# Altium schematic sheet sim_ckt.SchDoc
size 431 x 279 mm; SheetNumber: 1; SheetTotal: 2; SPICEModelCacheAEYVMEZK: <root> / <DocumentId>AEYVMEZK</DocumentId> / <CacheFrame Number="0"> / <Model Name="ad630" Kind="CKT"> / <Text>* AD630 SPICE Macro-model / * Description: Amplifier / * Generic Desc: Bipolar,  Balanced Modulator/Demod / * Developed by: ARG / PMI / * Revision History: 08/10/2012 - Updated to new header style / * 2.0 / *    Changed R1 and R2 to 20k ohms to meet comparator input voltage spec. / *    Changed E1 gain to 100k to better meet minimum comparator diff. input / *    spec. / *    Changed DZ breakdown from 30V to 50V. / *    Changed Ios1,Ios2 to 25E-9 and changed polarity. / * Copyright 1993, 2012 by Analog Devices. / * / * Refer to http://www.analog.com/Analog_Root/static/techSupport/designTools/spiceModels/license/spice_general.html for License Statement. Use of this model / * indicates your acceptance with the terms and provisions in the License Statement. / * / * BEGIN Notes: / * / * Not Modeled: / * / * Parameters modeled include: / * / * END Notes / * / * Node assignments / *             chan A non-inverting input / *             |  chan A inverting input / *             |  |  RIN A / *             |  |  |  chan B non-inverting input / *             |  |  |  |  chan B inverting input / *             |  |  |  |  |  RIN B / *             |  |  |  |  |  |  sel A / *             |  |  |  |  |  |  |  sel B / *             |  |  |  |  |  |  |  |  RB / *             |  |  |  |  |  |  |  |  |  RF / *             |  |  |  |  |  |  |  |  |  |  RA / *             |  |  |  |  |  |  |  |  |  |  |  comp / *             |  |  |  |  |  |  |  |  |  |  |  |  status / *             |  |  |  |  |  |  |  |  |  |  |  |  |  pos supply / *             |  |  |  |  |  |  |  |  |  |  |  |  |  |  neg supply / *             |  |  |  |  |  |  |  |  |  |  |  |  |  |  |  output / *             |  |  |  |  |  |  |  |  |  |  |  |  |  |  |  | / .SUBCKT AD630 11 10 19 21 20 24 25 29 47 49 48 52 51 99 50 46 / * / * COMPARATOR / * / V1   99   97   1 / I1   97   1    100.2E-6 / D1   1    97   DX / Q1   3    2    1    QP / Q2   5    4    1    QP / R1   3    50   20E3 / R2   5    50   20E3 / R4   25   2    1E3 / R5   29   4    1E3 / * / * COMPARATOR GAIN AND CLAMP / * / EREF 98   0    100 0 1 / E1   6    98   5 3 100E3 / R3   6    7    1E6 / D2   7    8    DX / D3   9    7    DX / V6   8    98   .2429 / V7   98   9    .2429 / Q7   51   53   50   QN / G11  99   53   7 100 100E-6 / D14  53   99   DY / * / * CHANNEL A AMPLIFIER AND POLE AT 1.7MHZ / * / R6   10   13   5E11 / R7   11   13   5E11 / IOS1 11   10   -5E-9 / CIN1 10   11   1E-12 / Q3   14   10   16   QN / Q4   15   12   17   QN / R8   99   14   12.736E3 / R9   99   15   12.736E3 / C1   14   15   3.675E-12 / R10  16   18   12.220E3 / R11  17   18   12.220E3 / G2   18   50   7 100 100.2E-6 / D4   50   18   DZ / R17  19   11   2.5E3 / EOS1 12   11   POLY(1) 35 100 50E-6 1 / * / * CHANNEL B AMPLIFIER / * / R12  20   23   5E11 / R13  23   21   5E11 / IOS2 21   20   -5E-9 / CIN2 20   21   1E-12 / Q5   14   20   26   QN / Q6   15   22   27   QN / R14  26   28   12.220E3 / R15  27   28   12.220E3 / G3   28   50   100 7 100.2E-6 / D5   50   28   DZ / R18  24   21   2.5E3 / EOS2 22   21   POLY(1) 37 100 50E-6 1 / * / * GAIN STAGE, SLEW RATE, AND DOMINANT POLE AT 5.623HZ / * / G1   98   30   15 14 78.518E-6 / RPI  30   98   12.736E3 / C2   30   33   2.222E-12 / GM1  33   98   30 0 1 / RL   33   98   1E6 / CC   30   52   2.75E-12 / D6   33   31   DX / D7   32   33   DX / V2   99   31   1.42 / V3   32   50   1.53 / * / * AMP A COMMON MODE STAGE AND ZERO AT 100HZ / * / R20  34   35   1E6 / R21  35   98   1 / C3   34   35   1.592E-9 / ECMA 34   98   13 100 3.162 / * / * AMP B COMMON MODE STAGE AND ZERO AT 100HZ / * / R22  36   37   1E6 / R23  37   98   1 / C4   36   37   1.592E-9 / ECMB 36   98   23 100 3.162 / * / * POLE AT 20MHZ / * / G5   98   39   33 100 1E-6 / R25  39   98   1E6 / C6   39   98   7.958E-15 / * / * POLE AT 20MHZ / * / G6   98   40   39 100 1E-6 / R26  40   98   1E6 / C7   40   98   7.958E-15 / * / * OUTPUT STAGE / * / ISY  99   50   3.6E-3 / R27  99   100  32.86E3 / R28  100  50   32.86E3 / R29  99   45   200 / R30  45   50   200 / L1   45   46   1E-10 / G9   45   99   99 40 5E-3 / G10  50   45   40 50 5E-3 / G7   43   50   40 45 5E-3 / G8   44   50   45 40 5E-3 / V4   41   45   1.9 / V5   45   42   1.9 / D8   40   41   DX / D9   42   40   DX / D10  99   43   DX / D11  99   44   DX / D12  50   43   DY / D13  50   44   DY / R31  46   49   10E3 / R32  49   47   10E3 / R33  49   48   5E3 / .MODEL QP PNP(BF=500) / .MODEL QN NPN(BF=500) / .MODEL DX D / .MODEL DY D(BV=50) / .MODEL DZ D(BV=50) / .ENDS AD630</Text> / </Model> / <Model Name="ada4610" Kind="CKT"> / <Text>*ADA4610 Macro-model / *Function:Amplifier / * / *Revision History: / *Rev.2.1 Feb 2016-ZZ / *Copyright 2016 by Analog Devices / * / *Refer to http://www.analog.com/Analog_Root/static/techSupport/designTools/spicemodels/license / *for License Statement. Use of this model indicates your acceptance / *of the terms and provisions in the License Staement. / * / *Tested on MultSIm, SiMetrix(NGSpice), PSpice / * / *Not modeled: Distortion, PSRR, Overload Recovery, / *             Shutdown Turn On/Turn Off time / * / *Parameters modeled include: / *   Vos, Ibias, Input CM limits and Typ output voltge swing over full supply range, / *   Open Loop Gain &amp; Phase, Slew Rate, Output current limits, Voltage &amp; Current Noise over temp, / *   Capacitive load drive, Quiescent and dynamic supply currents, / *   Shut Down pin functionality where applicable, / *   Single supply &amp; offset supply functionality. / * / *Node Assignments / *                Non-Inverting Input / *                |   Inverting Input / *                |   |   Positive supply / *                |   |   |   Negative supply / *                |   |   |   |   Output / *                |   |   |   |   | / .Subckt ADA4610 100 101 102 103 104 / *#ASSOC Category="Op-Amps" symbol=opamp / ***Power Supplies*** / Rz1    102    1020    Rideal    1e-6 / Rz2    103    1030    Rideal    1e-6 / Ibias    1020    1030    dc    0.33e-3 / DzPS    98    1020    diode / Iquies    1020    98    dc    2.97e-3 / S1    98    1030    106    113    Switch / R1    1020    99    Rideal    1e7 / R2    99    1030    Rideal    1e7 / e1    111    110    1020    110    1 / e2    110    112    110    1030    1 / e3    110    0    99    0    1 / * / * / ***Inputs*** / S2    1    100    106    113    Switch / S3    9    101    106    113    Switch / VOS    1    2    dc    0.2e-6 / IbiasP    110    2    dc    5e-12 / IbiasN    110    9    dc    5e-12 / RinCMP    110    2    Rideal    20000000000000e6 / RinCMN    9    110    Rideal    20000000000000e6 / CinCMP    110    2    5.7e-12 / CinCMN    9    110    5.7e-12 / IOS    9    2    2e-12 / RinDiff    9    2    Rideal    20000000000000e3 / CinDiff    9    2    2.2e-12 / * / * / ***Non-Inverting Input with Clamp*** / g1    3    110    110    2    0.001 / RInP    3    110    Rideal    1e3 / RX1    40    3    Rideal    0.001 / DInP    40    41    diode / DInN    42    40    diode / VinP    111    41    dc    2.96 / VinN    42    112    dc    2.96 / * / * / ***Vnoise*** / hVn    6    5    Vmeas1    707.10678 / Vmeas1    20    110    DC    0 / Vvn    21    110    dc    0.65 / Dvn    21    20    DVnoisy / hVn1    6    7    Vmeas2    707.10678 / Vmeas2    22    110    dc    0 / Vvn1    23    110    dc    0.65 / Dvn1    23    22    DVnoisy / * / * / ***Inoise*** / FnIN    9    110    Vmeas3    0.7071068 / Vmeas3    51    110    dc    0 / VnIN    50    110    dc    0.65 / DnIN    50    51    DINnoisy / FnIN1    110    9    Vmeas4    0.7071068 / Vmeas4    53    110    dc    0 / VnIN1    52    110    dc    0.65 / DnIN1    52    53    DINnoisy / * / FnIP    2    110    Vmeas5    0.7071068 / Vmeas5    31    110    dc    0 / VnIP    30    110    dc    0.65 / DnIP    30    31    DIPnoisy / FnIP1    110    2    Vmeas6    0.7071068 / Vmeas6    33    110    dc    0 / VnIP1    32    110    dc    0.65 / DnIP1    32    33    DIPnoisy / * / * / ***CMRR*** / RcmrrP    3    10    Rideal    1e12 / RcmrrN    10    9    Rideal    1e12 / g10    11    110    10    110    -1e-10 / Lcmrr    11    12    1e-12 / Rcmrr    12    110    Rideal    1e3 / e4    5    3    11    110    1 / * / * / ***Power Down*** / VPD    111    80    dc    2 / VPD1    81    0    dc    1.5 / RPD    111    106    Rideal    0.286e6 / ePD    80    113    82    0    1 / RDP1    82    0    Rideal    1e3 / CPD    82    0    1e-10 / S5    81    82    83    113    Switch / CDP1    83    0    1e-12 / RPD2    106    83    1e6 / * / * / ***Feedback Pin*** / *RF    105    104    Rideal    0.001 / * / * / ***VFB Stage*** / g200    200    110    7    9    1 / R200    200    110    Rideal    250 / DzSlewP    201    200    DzSlewP / DzSlewN    201    110    DzSlewN / * / * / ***Dominant Pole at 350 Hz*** / g210    210    110    200    110    0.3502e-6 / R210    210    110    Rideal    454.73e6 / C210    210    110    1e-012 / * / * / ***Output Voltage Clamp-1*** / RX2    60    210    Rideal    0.001 / DzVoutP    61    60    DzVoutP / DzVoutN    60    62    DzVoutN / DVoutP    61    63    diode / DVoutN    64    62    diode / VoutP    65    63    dc    5.709 / VoutN    64    66    dc    5.428 / e60    65    110    111    110    1.34 / e61    66    110    112    110    1.34 / * / * / ***Pole-Zero at 84KHz, 180KHz*** / g220    220    110    210    110    0.001 / R220    220    110    Rideal    1000 / R221    220    221    Rideal    0.875e3 / C220    221    110    1010.5064e-12 / * / ***Pole at 110MHz*** / g230    230    110    220    110    0.001 / R230    230    110    Rideal    1000 / C230    230    110    1.4469e-12 / * / ***Buffer*** / g240    240    110    230    110    0.001 / R240    240    110    Rideal    1000 / * / ***Buffer*** / g245    245    110    240    110    0.001 / R245    245    110    Rideal    1000 / * / ***Buffer*** / g250    250    110    245    110    0.001 / R250    250    110    Rideal    1000 / * / ***Buffer*** / g255    255    110    250    110    0.001 / R255    255    110    Rideal    1000 / * / ***Buffer*** / g260    260    110    255    110    0.001 / R260    260    110    Rideal    1000 / * / ***Buffer*** / g265    265    110    260    110    0.001 / R265    265    110    Rideal    1000 / * / ***Buffer*** / g270    270    110    265    110    0.001 / R270    270    110    Rideal    1000 / * / ***Notch: f=2.2MHz, Zeta=1.2, Gain=0.8dB*** / e280    280    110    270    110    1 / R280    280    285    Rideal    10 / L280    285    281    3425.757e-9 / C280    281    282    1527.698e-12 / R281    282    110    Rideal    103.65 / * / ***Peak: f=0.5MHz, Zeta=3.1, Gain=5.1dB*** / e290    290    110    285    110    1 / R290    290    292    Rideal    10 / L290    290    291    513.402e-9 / C290    291    292    197351.907e-12 / R291    292    110    Rideal    12.518 / e295    295    110    292    110    1.7989 / * / * / ***Output Stage*** / g300    300    110    295    110    0.001 / R300    300    110    Rideal    1000 / e301    301    110    300    110    1 / Rout    302    303    Rideal     163 / Lout    303    310     80e-9 / Cout    310    110     6e-12 / * / * / ***Output Current Limit*** / H1    301    304    Vsense1    100 / Vsense1    301    302    dc    0 / VIoutP    305    304    dc    5.736 / VIoutN    304    306    dc    5.736 / DIoutP    307    305    diode / DIoutN    306    307    diode / Rx3    307    300    Rideal    0.001 / * / * / ***Output Clamp-2*** / VoutP1    111    73    dc    0.785 / VoutN1    74    112    dc    0.785 / DVoutP1    75    73    diode / DVoutN1    74    75    diode / RX4    75    310    Rideal    0.001 / * / * / ***Supply Currents*** / FIoVcc    314    110    Vmeas8    1 / Vmeas8    310    311    dc    0 / R314    110    314    Rideal    1e9 / DzOVcc    110    314    diode / DOVcc    102    314    diode / RX5    311    312    Rideal    0.001 / FIoVee    315    110    Vmeas9    1 / Vmeas9    312    313    dc    0 / R315    315    110    Rideal    1e9 / DzOVee    315    110    diode / DOVee    315    103    diode / * / * / ***Output Switch*** / S4    104    313    106    113    Switch / * / * / *** Common Models *** / .model    diode    d(bv=100) / .model    Switch    vswitch(Von=1.505,Voff=1.495,ron=0.001,roff=1e6) / .model    DzVoutP    D(BV=4.3) / .model    DzVoutN    D(BV=4.3) / .model    DzSlewP    D(BV=174.665) / .model    DzSlewN    D(BV=174.665) / .model    DVnoisy    D(IS=2.03e-15 KF=8.16e-18) / .model    DINnoisy    D(IS=1.45e-22 KF=8.13e-18) / .model    DIPnoisy    D(IS=1.45e-22 KF=8.13e-18) / .model    Rideal    res(T_ABS=-273) / * / .ends ADA4610</Text> / </Model> / </CacheFrame> / </root>
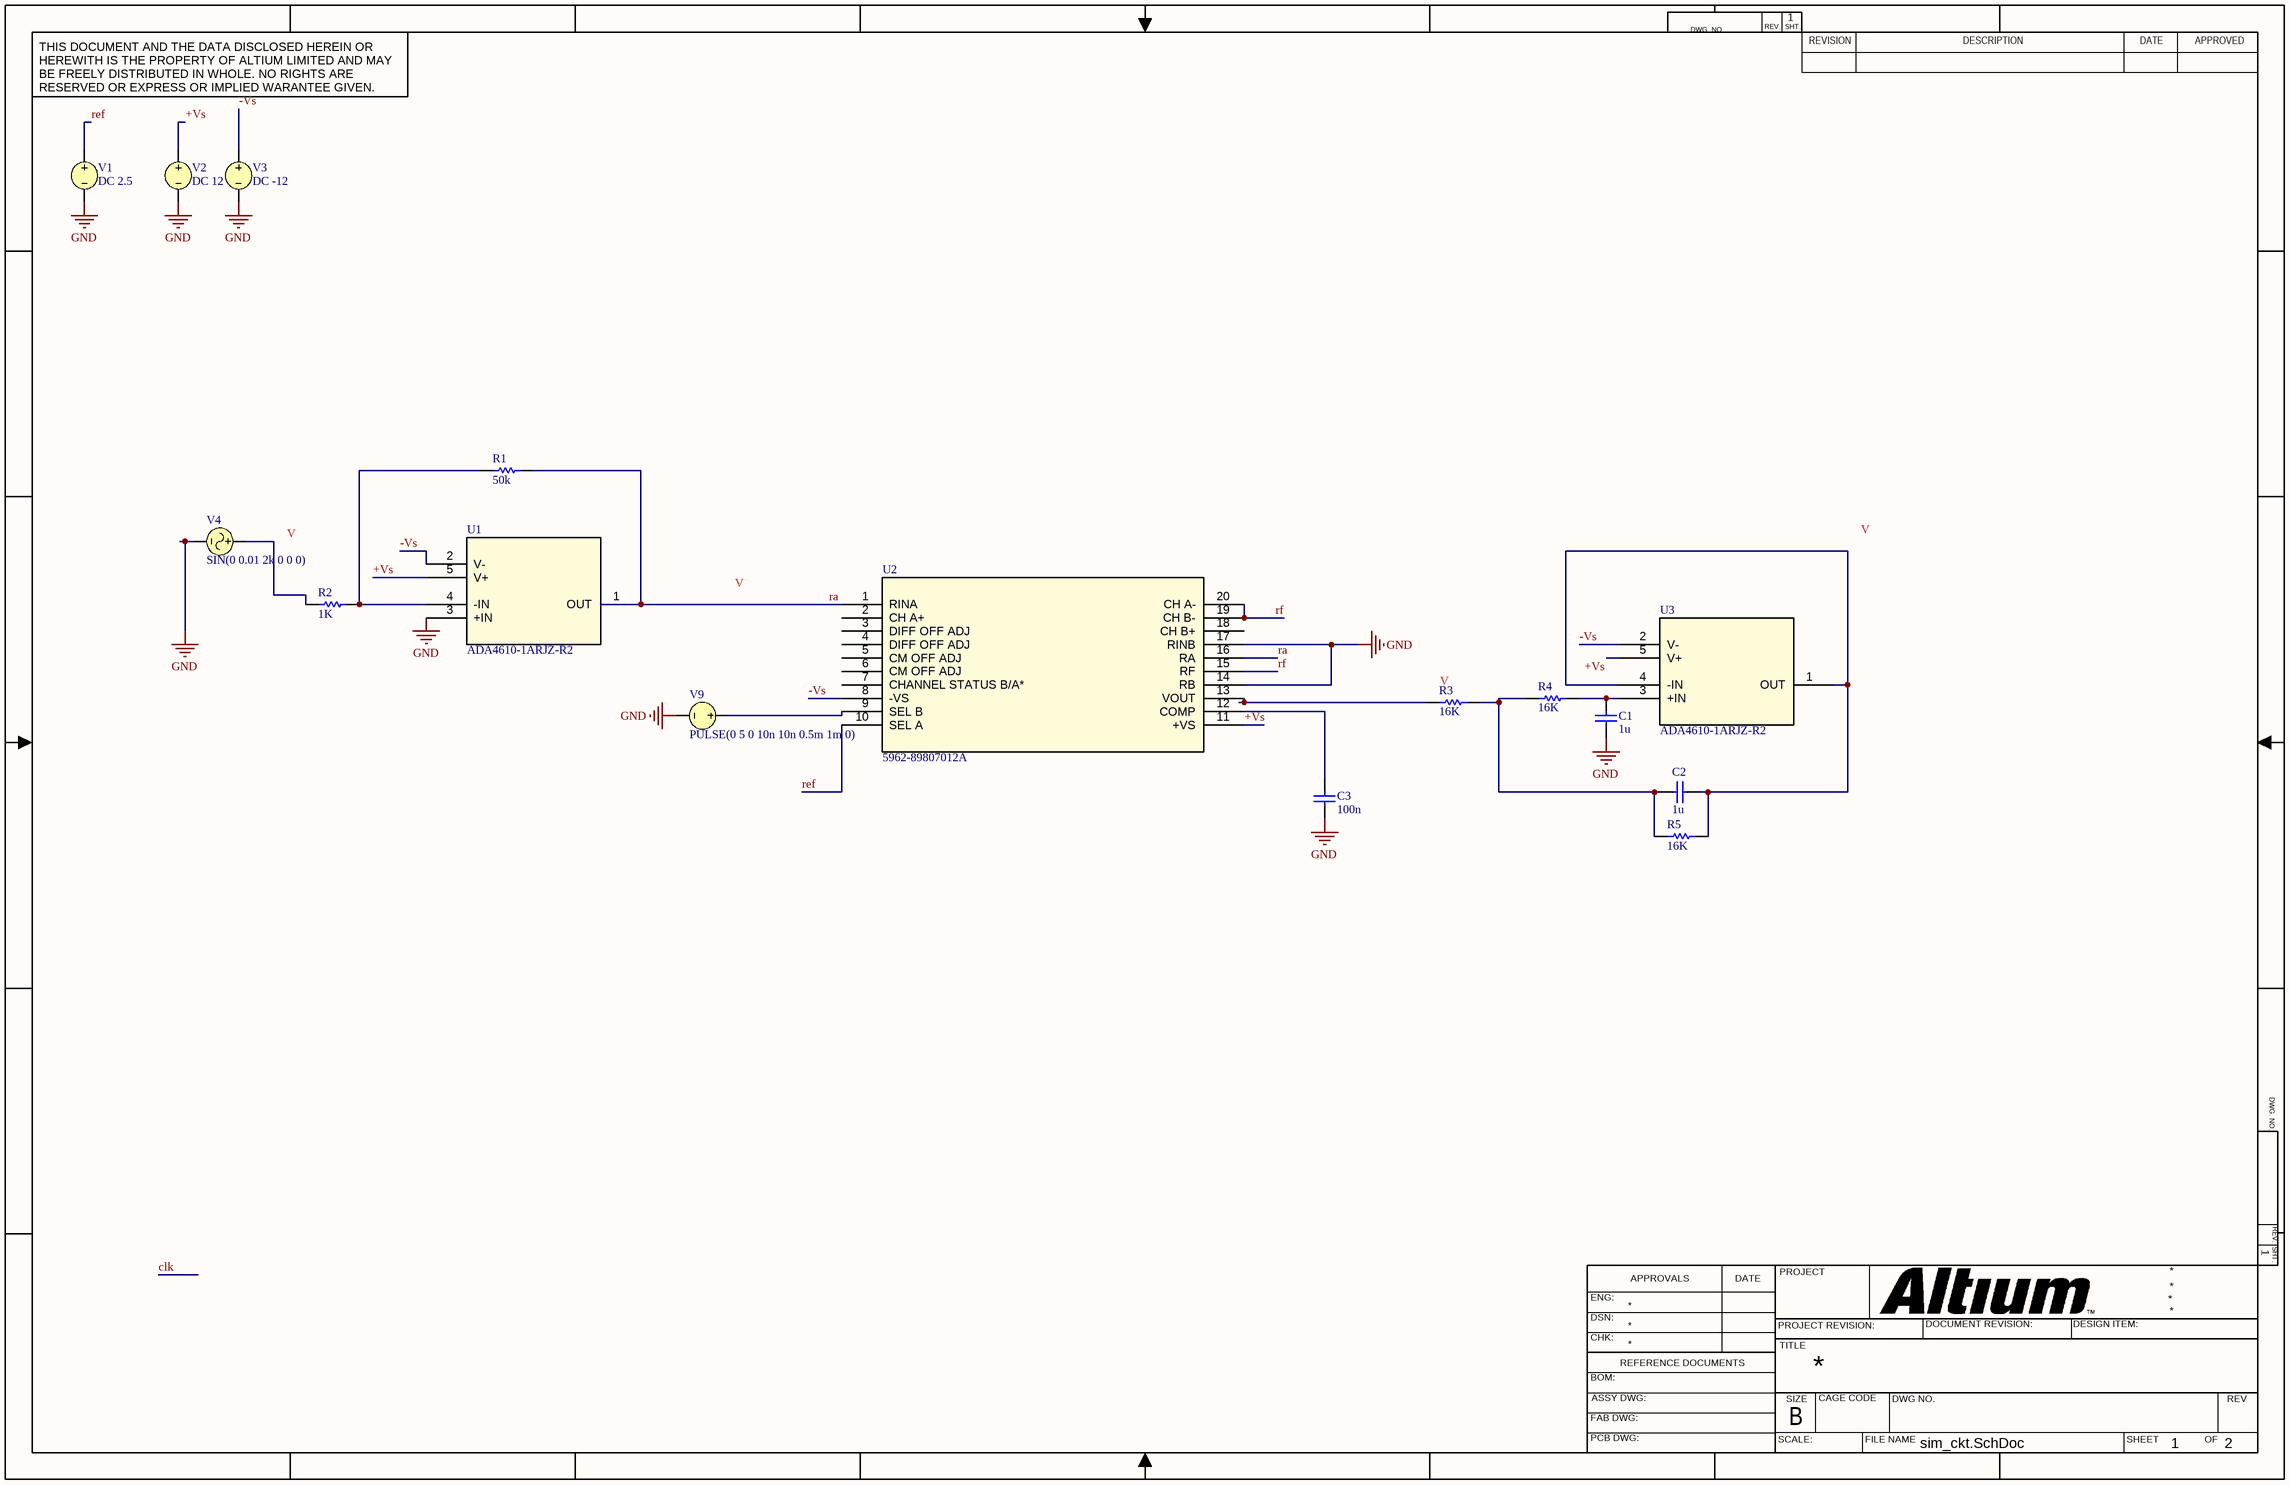
[diagram p0: sim_ckt.SchDoc]

## Parts
C1  value 1u  (hidden comment: Capacitor)
C2  value 1u  (hidden comment: Capacitor)
C3  value 100n  (hidden comment: Capacitor)
R1  value 50k  (hidden comment: Resistor)
R2  value 1K  (hidden comment: Resistor)
R3  value 16K  (hidden comment: Resistor)
R4  value 16K  (hidden comment: Resistor)
R5  value 16K  (hidden comment: Resistor)
U1  ADA4610-1ARJZ-R2  [RJ_5_ADI]
U2  5962-89807012A  [E_20_1_ADI]
U3  ADA4610-1ARJZ-R2  [RJ_5_ADI]
V1  DC 2.5
V2  DC 12
V3  DC -12
V4  SIN(0 0.01 2k 0 0 0)
V9  PULSE(0 5 0 10n 10n 0.5m 1m 0)

## Nets
GND: C1.1 C3.2 U1.3(+IN) U2.14(RB) U2.17(RINB) V1.2 V2.2 V3.2 V4.2 V9.2
+Vs: U1.5(V+) U2.11(+VS) U3.5(V+) V2.1
-Vs: U1.2(V-) U2.8(-VS) U3.2(V-) V3.1
ra: R1.2 U1.1(OUT) U2.1(RINA) U2.16(RA)
ref: U2.10(SEL_A) V1.1
rf: U2.15(RF) U2.19(CH_B-) U2.20(CH_A-)
NetC1_2: C1.2 R4.2 U3.3(+IN)
NetC2_1: C2.1 R3.2 R4.1 R5.1
NetC2_2: C2.2 R5.2 U3.1(OUT) U3.4(-IN)
NetC3_1: C3.1 U2.12(COMP)
NetR1_1: R1.1 R2.2 U1.4(-IN)
NetR2_1: R2.1 V4.1
NetR3_1: R3.1 U2.13(VOUT)
NetU2_9: U2.9(SEL_B) V9.1

Not connected (* = marked no-connect by the designer): U2 2(CH_A+) 3(DIFF_OFF_ADJ) 4(DIFF_OFF_ADJ) 5(CM_OFF_ADJ) 6(CM_OFF_ADJ) 7(CHANNEL_STATUS_B/A*) 18(CH_B+)

## Notes on the sheet
- DWG. NO.
- REV.
- SHT.
- THIS DOCUMENT AND THE DATA DISCLOSED HEREIN OR HEREWITH IS THE PROPERTY OF ALTIUM LIMITED AND MAY BE FREELY DISTRIBUTED IN WHOLE. NO RIGHTS ARE RESERVED OR EXPRESS OR IMPLIED WARANTEE GIVEN.
- REVISION
- DESCRIPTION
- DATE
- APPROVED
- ENG:
- APPROVALS
- PROJECT
- DSN:
- CHK:
- REFERENCE DOCUMENTS
- PROJECT REVISION:
- TITLE
- DOCUMENT REVISION:
- DESIGN ITEM:
- BOM:
- FAB DWG:
- PCB DWG:
- ASSY DWG:
- SCALE:
- SIZE
- B
- CAGE CODE
- FILE NAME
- DWG NO.
- SHEET
- OF
- REV

## Library data of the parts
C1-C3 = Capacitor: SimulationGenericComponent: True
R1-R5 = Resistor: TC1: 0; SimulationGenericComponent: True; TC2: 0
U1 U3 = ADA4610-1ARJZ-R2: Low Noise, Precision, Rail-to-Rail Output, JFET Single Op Amp; Manufacturer_Name: Analog Devices Inc; Copyright: Copyright (C) 2026 Ultra Librarian. All rights reserved.; Manufacturer_Part_Number: ADA4610-1ARJZ-R2; RefDes: RefDes; Type: Type
U2 = 5962-89807012A: Balanced Modulator/Demodulator; Manufacturer_Name: Analog Devices Inc; Copyright: Copyright (C) 2026 Ultra Librarian. All rights reserved.; Manufacturer_Part_Number: 5962-89807012A; Datasheet: https://www.analog.com/media/en/technical-documentation/data-sheets/AD630.pdf; RefDes: RefDes; Type: Type
V1 = VSRC: Voltage Source; Note: PCB Footprint - Not required; AC Magnitude: 1; AC Phase: 0; Value: 2.5; Published: 8-Jun-2000; LatestRevisionDate: 17-Jul-2002; LatestRevisionNote: Re-released for DXP Platform.; PackageReference: Not Applicable; Publisher: Altium Limited
V2 = VSRC: Voltage Source; Note: PCB Footprint - Not required; AC Magnitude: 1; AC Phase: 0; Value: 12; Published: 8-Jun-2000; LatestRevisionDate: 17-Jul-2002; LatestRevisionNote: Re-released for DXP Platform.; PackageReference: Not Applicable; Publisher: Altium Limited
V3 = VSRC: Voltage Source; Note: PCB Footprint - Not required; AC Magnitude: 1; AC Phase: 0; Published: 8-Jun-2000; LatestRevisionDate: 17-Jul-2002; LatestRevisionNote: Re-released for DXP Platform.; PackageReference: Not Applicable; Publisher: Altium Limited; Value: -12
V4 = VSIN: Sinusoidal Voltage Source; Note: PCB Footprint - Not required; Offset: 0; Amplitude: 0.01; AC Magnitude: 1; Published: 8-Jun-2000; LatestRevisionDate: 15-Nov-2004; LatestRevisionNote: Corrected Netlist.; PackageReference: Not Applicable; Publisher: Altium Limited; Frequency: 2k; Delay: 0; Damping Factor: 0; Phase: 0; DC Magnitude: 0; AC Phase: 0
V9 = VSRC: Voltage Source; Note: PCB Footprint - Not required; AC Magnitude: 1; AC Phase: 0; DC Magnitude: 5; Published: 8-Jun-2000; LatestRevisionDate: 17-Jul-2002; LatestRevisionNote: Re-released for DXP Platform.; PackageReference: Not Applicable; Publisher: Altium Limited; Initial Value: 0; Pulsed Value: 5; Time Delay: 0; Rise Time: 10n; Fall Time: 10n; Pulse Width: 0.5m; Period: 1m; Phase: 0